# Altium schematic sheet Sheet2.SchDoc
size A; SheetNumber: 1; SheetTotal: 1
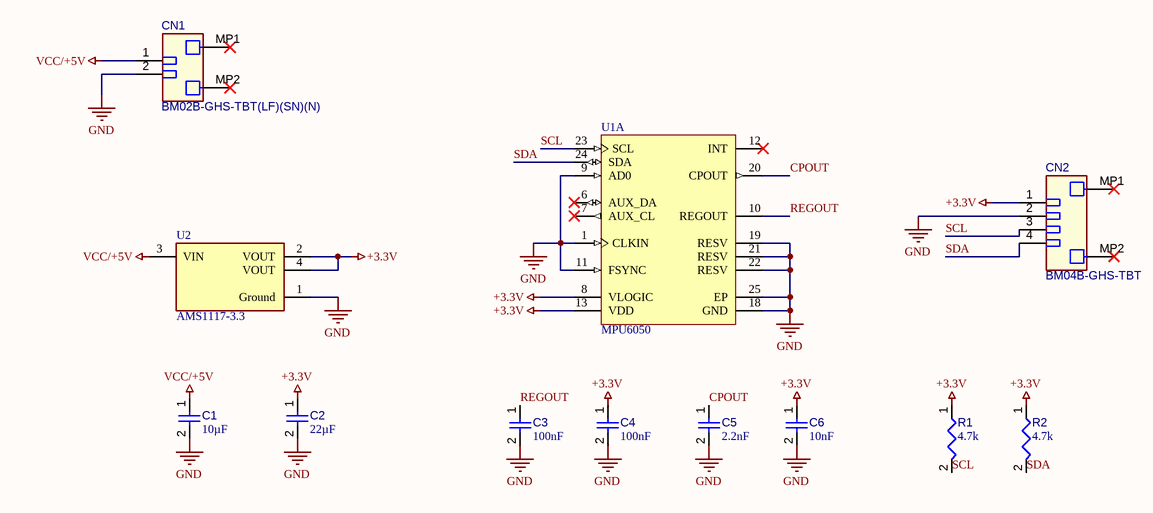
[diagram p0: Sheet2.SchDoc]

## Parts
C1  value 10µF  [CAPC0603(1608)100_L]  (hidden comment: Capacitor 10µF +/-20% 10V 0603)
C2  value 22µF  [CAPC0805(2012)145_L]  (hidden comment: Capacitor 22µF +/-40% 16V 0805)
C3  value 100nF  [CAPC1005X56X25LL10T15]  (hidden comment: Capacitor 0.1 uF +/- 5% 16 V 0402)
C4  value 100nF  [CAPC1005X56X25LL10T15]  (hidden comment: Capacitor 0.1 uF +/- 5% 16 V 0402)
C5  value 2.2nF  [CAPC0402(1005)60_L]  (hidden comment: Capacitor 2,2µF +/-20% 10V 0402)
C6  value 10nF  [CAPC0402(1005)60_L]  (hidden comment: Capacitor 2,2µF +/-20% 10V 0402)
CN1  BM02B-GHS-TBT(LF)(SN)(N)  [JST-BM02B-GHS-TBT_V]
CN2  BM04B-GHS-TBT  [JST-BM04B-GHS-TBT_V]
R1  value 4.7k  [RESC0805(2012)_L]  (hidden comment: 470R5J)
R2  value 4.7k  [RESC0805(2012)_L]  (hidden comment: 470R5J)
U1  MPU6050  [INSE-QFN-24_V]  (part A of 2)
U2  AMS1117-3.3  [FP-AMS1117-IPC_C]

## Nets
+3.3V: C2.1 C4.1 C6.1 CN2.1 R1.1 R2.1 U1.8(VLOGIC) U1.13(VDD) U2.2(VOUT) U2.4(VOUT)
GND: C1.2 C2.2 C3.2 C4.2 C5.2 C6.2 CN1.2 CN2.2 U1.1(CLKIN) U1.9(AD0) U1.11(FSYNC) U1.18(GND) U1.19(RESV) U1.21(RESV) U1.22(RESV) U1.25(EP) U2.1(Ground)
VCC/+5V: C1.1 CN1.1 U2.3(VIN)
CPOUT: C5.1 U1.20(CPOUT)
REGOUT: C3.1 U1.10(REGOUT)
SCL: CN2.3 R1.2 U1.23(SCL)
SDA: CN2.4 R2.2 U1.24(SDA)

Not connected (* = marked no-connect by the designer): CN1 MP1* MP2*; CN2 MP1* MP2*; U1 6(AUX_DA)* 7(AUX_CL)* 12(INT)*

## Library data of the parts
C1 = CMP-001-00075-4: Chip Capacitor, 10µF +/-20%, 10V, 0603, Thickness 1 mm; Tolerance: 10%; Voltage Rating: 10V; Max Operating Temperature: 85°C; Pins: 2; Case/Package: 0603; Mounting Technology: SMT; Min Operating Temperature: -55°C
C2 = CMP-001-00081-4: Chip Capacitor, 22µF +/-40%, 16V, 0805, Thickness 1.45 mm; Tolerance: 5%; Voltage Rating: 16V; Mounting Technology: SMT; Pins: 2; Max Operating Temperature: 85°C; Case/Package: 0805; Min Operating Temperature: -55°C
C3 C4 = CMP-001-00001-6: Chip Capacitor, 0.1 uF, +/- 5%, 16 V, 0402 (1005 Metric); Capacitor Type: Ceramic; Voltage Rating: 16V; Max Operating Temperature: 125°C; Min Operating Temperature: -55°C; Case/Package: 0402; Mounting Technology: SM; Pins: 2; Tolerance: 5%; RoHS Compliant: True
C5 C6 = CMP-001-00056-4: Chip Capacitor, 2,2µF +/-20%, 10V, 0402, Thickness 0.6 mm; Tolerance: 10%; Mounting Technology: SMT; Max Operating Temperature: 85°C; Case/Package: 0402; Pins: 2; Min Operating Temperature: -55°C; Voltage Rating: 10V
CN1 = CMP-002-00061-3: Disconnectable Crimp Style Connector, Pitch 1.25 mm, 1 x 2 Position, Height 4.05 mm, -25 to 85 degC, RoHS, Tape and Reel; Connector Type: Header,Shrouded; Mounting Technology: SurfaceMount; Case/Package: Disconnectable Crimp Style Connector, Pitch 1.25 mm, 1 x 2 Position, Height 4.05 mm; Pins: 4
CN2 = CMP-002-00053-3: Header, Pitch 1.25 mm, 1 x 4 Position, Height 4.05 mm, -25 to 85 degC; Pins: 6
R1 R2 = CMP-009-00102-2: 470R 0.125W 5% 0805 (2012 Metric)  SMD; Power: 125mW; Pins: 2; Case/Package: 0805; Mounting Technology: SMT; Tolerance: 5%
U1 = CMP-010-00014-3: 3-Axis Gyroscope, 3-Axis Accelerometer, 2.375 to 3.46 V, -40 to 105 degC, 24-Pin QFN, RoHS, Tape and Reel; Manufacturer: InvenSense; Max Supply Voltage: 3.6V; Min Supply Voltage: 2.5V; Sensor Type: Motion; Interface: I2C; Min Operating Temperature: -40°C; Case/Package: QFN; Package Quantity: 5000; Pins: 24; RoHS Compliant: True; Packaging: CutTape; Datasheet URL: https://datasheet.ciiva.com/1513/1788002-1513632.pdf; Package Reference: QFN-24; Datasheet Version: Rev. 3.4, 08/2013; Package Description: 24-Pin Quad Flat No-lead Package, Body 4 x 4 mm, Pitch 0.5 mm; Max Operating Temperature: 85°C; Mounting Technology: SM
U2 = CMP-209535-000001-1: LDO Voltage Regulators 1A, 3.3V; Manufacturer: Advanced Monolithic Systems; Dropout Voltage: 1.1V; Output Type: Fixed; Nominal Supply Current: 5mA; Max Power Dissipation: 1.2W; Max Supply Voltage: 15V; Number Of Outputs: 1; Standoff Height: 0.64mm; Max Junction Temp: +125°C; Height: 1.8mm; Package: AMS1117; Device Class L2: Power Management ICs; ComponentLink2Description: Datasheet; ComponentLink2URL: http://www.advanced-monolithic.com/pdf/ds1117.pdf; Category: IC; RoHS: TRUE; Automotive: No; Device Class L1: Integrated Circuits (ICs); Output Current: 1A; Device Class L3: Voltage Regulators - Linear; Temperature: -40°C to +125°C; Output Voltage: 3.3V; Manufacturer Part Number: AMS1117-3.3; Temperature Range Low: -40°C; Octopart: https://octopart.com/ams1117-3.3-advanced+monolithic+systems-25899300; Lead Free: Yes; Ipc Land Pattern Name: SOT229P700X180-4; Temperature Range High: +125°C